# Altium schematic sheet Speaker.SchDoc
size A; SheetNumber: 14; SheetTotal: 15
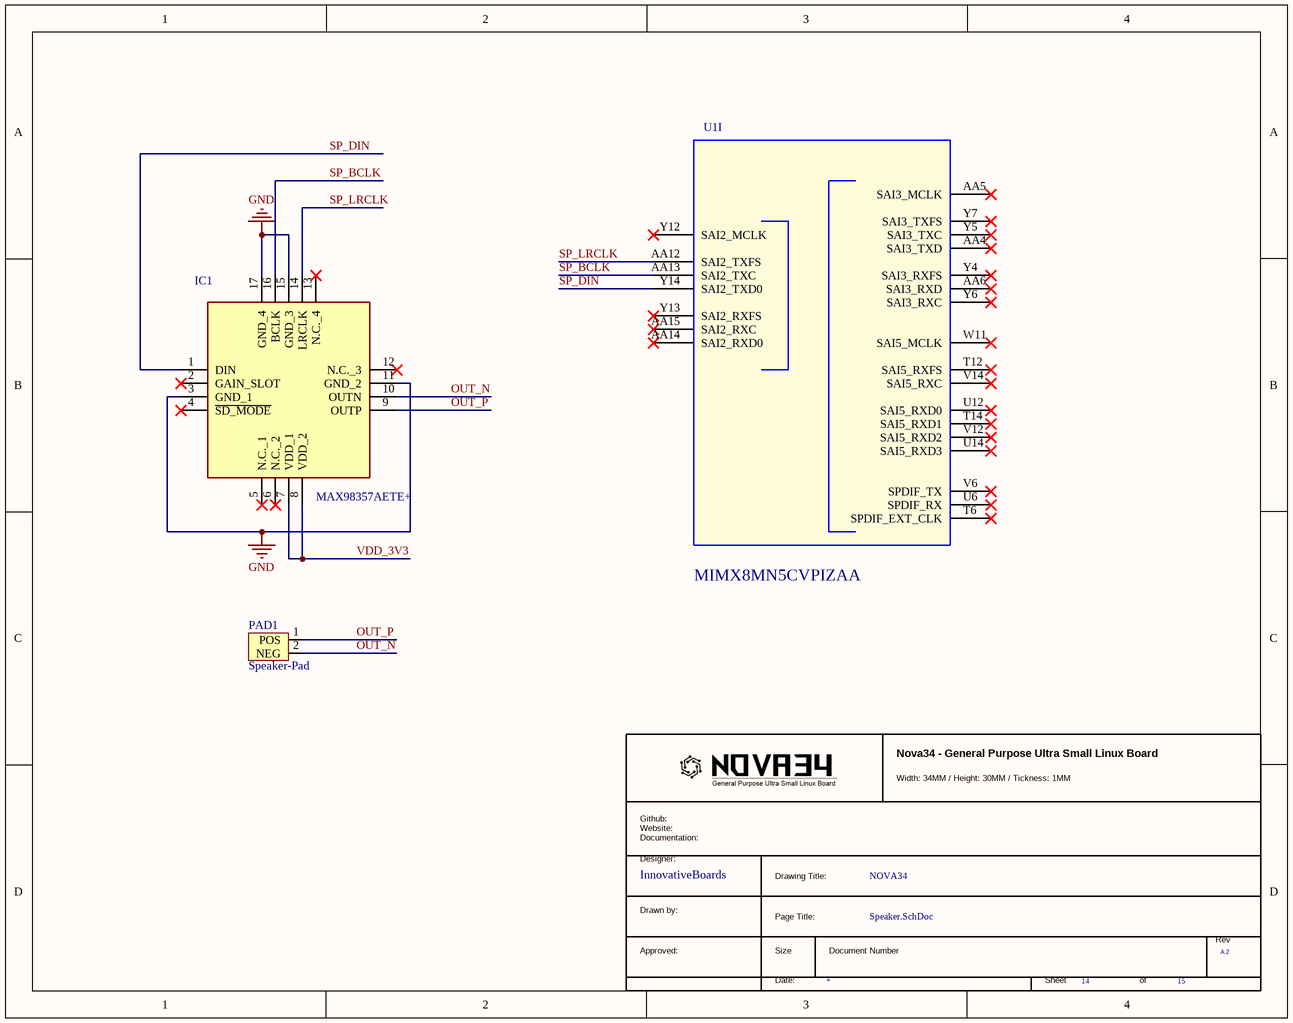
[diagram p0: Speaker.SchDoc]

## Parts
*  RevCode: A.2  (hidden comment: TitleBlock_MCPG)  (graphical)
IC1  MAX98357AETE+  [QFN50P300X300X80-17N]
PAD1  Speaker-Pad  [Speaker-Pad]
U1  MIMX8MN5CVPIZAA  [BGA306C50P21X21_1100X1100X101]  (part I of 12)

## Nets
GND: IC1.3(GND_1) IC1.11(GND_2) IC1.15(GND_3) IC1.17(GND_4)
OUT_N: IC1.10(OUTN) PAD1.2(NEG)
OUT_P: IC1.9(OUTP) PAD1.1(POS)
SP_BCLK: IC1.16(BCLK) U1.AA13(SAI2_TXC)
SP_DIN: IC1.1(DIN) U1.Y14(SAI2_TXD0)
SP_LRCLK: IC1.14(LRCLK) U1.AA12(SAI2_TXFS)
VDD_3V3: IC1.7(VDD_1) IC1.8(VDD_2)

Not connected (* = marked no-connect by the designer): IC1 2(GAIN_SLOT)* 4(~{SD_MODE})* 5(N.C._1)* 6(N.C._2)* 12(N.C._3)* 13(N.C._4)*; U1 AA4(SAI3_TXD)* AA5(SAI3_MCLK)* AA6(SAI3_RXD)* AA14(SAI2_RXD0)* AA15(SAI2_RXC)* T6(SPDIF_EXT_CLK)* T12(SAI5_RXFS)* T14(SAI5_RXD1)* U6(SPDIF_RX)* U12(SAI5_RXD0)* U14(SAI5_RXD3)* V6(SPDIF_TX)* V12(SAI5_RXD2)* V14(SAI5_RXC)* W11(SAI5_MCLK)* Y4(SAI3_RXFS)* Y5(SAI3_TXC)* Y6(SAI3_RXC)* Y7(SAI3_TXFS)* Y12(SAI2_MCLK)* Y13(SAI2_RXFS)*

## Notes on the sheet
- (in symbol TitleBlock_MCPG) Nova34 - General Purpose Ultra Small Linux Board; Width: 34MM / Height: 30MM / Tickness: 1MM; Github: / Website: / Documentation:; Designer:; InnovativeBoards; Drawing Title:; NOVA34; Drawn by:; Page Title:; Rev; Approved:; Size; Document Number; Date:; Sheet; of

## Library data of the parts
IC1 = MAX98357AETE+: Integrated Circuit; Manufacturer_Name: Analog Devices; Datasheet Link: https://datasheets.maximintegrated.com/en/ds/MAX98357A-MAX98357B.pdf; Height: 0.8mm; Manufacturer_Part_Number: MAX98357AETE+; Mouser Part Number: 700-MAX98357AETE+; Mouser Price/Stock: https://www.mouser.co.uk/ProductDetail/Analog-Devices-Maxim-Integrated/MAX98357AETE%2b?qs=AAveGqk956EyS6m3AmZeuw%3D%3D
U1 = MIMX8MN: IC CPU QUAD CORTEX A53+M7 1.4GHZ -- BGA306; PCB Footprint: pbga306_0p5_sq11mm; AGILE_PN: TMP-CIP-5098; CAD_APPROVED: Yes; PRE_APN: 330-77152; Temp Range: -40¡ãC to 105¡ãC; MFG_NAME01: NXP SEMICONDUCTORS; CLASS: IC; HEIGHT: 1.01MM; ROHS: Yes; MFG_PN01: MIMX8MN5CVPIZAA
* = TitleBlock_MCPG: Page Create Date: March  8, 1995